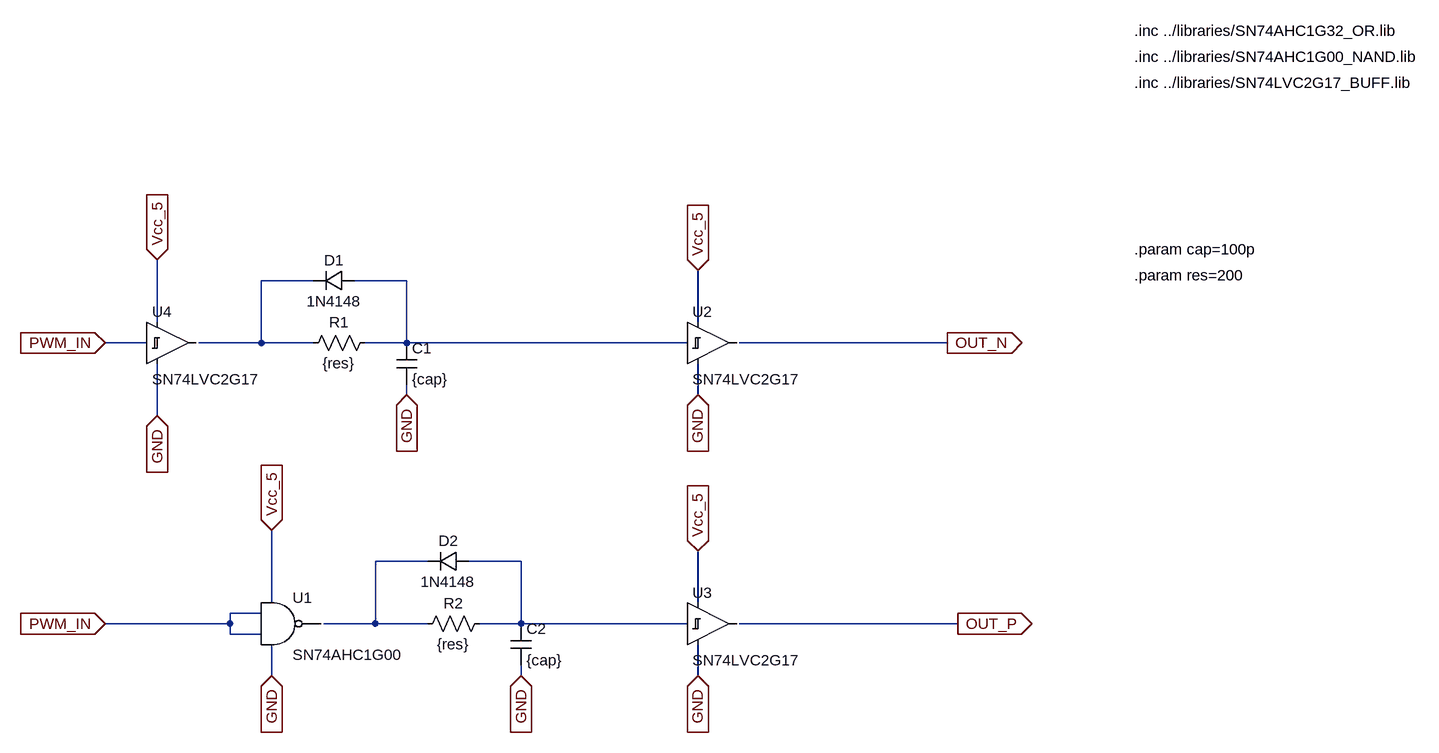
[diagram p0: schematic Deadtime_component.asc]
Deadtime_component.asc, the LTspice schematic file:
Version 4
SHEET 1 1604 848
WIRE -640 80 -720 80
WIRE -496 80 -576 80
WIRE -880 144 -880 48
WIRE -48 144 -48 64
WIRE -896 176 -960 176
WIRE -720 176 -720 80
WIRE -720 176 -816 176
WIRE -640 176 -720 176
WIRE -496 176 -496 80
WIRE -496 176 -560 176
WIRE -64 176 -496 176
WIRE 336 176 16 176
WIRE -496 256 -496 240
WIRE -48 256 -48 208
WIRE -880 288 -880 208
WIRE -464 512 -544 512
WIRE -320 512 -400 512
WIRE -704 576 -704 464
WIRE -48 576 -48 496
WIRE -720 592 -768 592
WIRE -768 608 -768 592
WIRE -768 608 -960 608
WIRE -544 608 -544 512
WIRE -544 608 -624 608
WIRE -464 608 -544 608
WIRE -320 608 -320 512
WIRE -320 608 -384 608
WIRE -64 608 -320 608
WIRE 352 608 16 608
WIRE -768 624 -768 608
WIRE -720 624 -768 624
WIRE -704 688 -704 640
WIRE -320 688 -320 672
WIRE -48 688 -48 640
FLAG 352 608 OUT_P
IOPIN 352 608 Out
FLAG 336 176 OUT_N
IOPIN 336 176 Out
FLAG -960 608 PWM_IN
IOPIN -960 608 In
FLAG -496 256 GND
IOPIN -496 256 In
FLAG -960 176 PWM_IN
IOPIN -960 176 In
FLAG -320 688 GND
IOPIN -320 688 In
FLAG -48 688 GND
IOPIN -48 688 In
FLAG -48 256 GND
IOPIN -48 256 In
FLAG -48 64 Vcc_5
IOPIN -48 64 In
FLAG -48 496 Vcc_5
IOPIN -48 496 In
FLAG -704 464 Vcc_5
IOPIN -704 464 In
FLAG -704 688 GND
IOPIN -704 688 In
FLAG -880 48 Vcc_5
IOPIN -880 48 In
FLAG -880 288 GND
IOPIN -880 288 In
SYMBOL res -544 160 R90
WINDOW 0 0 56 VBottom 2
WINDOW 3 32 56 VTop 2
SYMATTR InstName R1
SYMATTR Value {res}
SYMBOL cap -512 176 R0
SYMATTR InstName C1
SYMATTR Value {cap}
SYMBOL diode -576 64 R90
WINDOW 0 0 32 VBottom 2
WINDOW 3 32 32 VTop 2
SYMATTR InstName D1
SYMATTR Value 1N4148
SYMBOL res -368 592 R90
WINDOW 0 0 56 VBottom 2
WINDOW 3 32 56 VTop 2
SYMATTR InstName R2
SYMATTR Value {res}
SYMBOL cap -336 608 R0
SYMATTR InstName C2
SYMATTR Value {cap}
SYMBOL diode -400 496 R90
WINDOW 0 0 32 VBottom 2
WINDOW 3 32 32 VTop 2
SYMATTR InstName D2
SYMATTR Value 1N4148
SYMBOL my_nand -688 544 R0
SYMATTR InstName U1
SYMBOL schmitt_buffer -64 112 R0
SYMATTR InstName U2
SYMBOL schmitt_buffer -64 544 R0
SYMATTR InstName U3
SYMBOL schmitt_buffer -896 112 R0
SYMATTR InstName U4
TEXT 624 -304 Left 2 !.inc ../libraries/SN74AHC1G32_OR.lib
TEXT 624 -264 Left 2 !.inc ../libraries/SN74AHC1G00_NAND.lib
TEXT 624 -224 Left 2 !.inc ../libraries/SN74LVC2G17_BUFF.lib
TEXT 624 32 Left 2 !.param cap=100p
TEXT 624 72 Left 2 !.param res=200

The netlist it stands for:
* Deadtime_component.asc
R1 N002 N001 {res}
C1 N002 GND {cap}
D1 N002 N001 1N4148
R2 N004 N003 {res}
C2 N004 GND {cap}
D2 N004 N003 1N4148
XU1 N003 PWM_IN PWM_IN Vcc_5 GND SN74AHC1G00  ; pins Y A B VCC AGND
XU2 OUT_N N002 Vcc_5 GND SN74LVC2G17  ; pins Y A VCC AGND
XU3 OUT_P N004 Vcc_5 GND SN74LVC2G17  ; pins Y A VCC AGND
XU4 N001 PWM_IN Vcc_5 GND SN74LVC2G17  ; pins Y A VCC AGND
.model D D
.lib standard.dio
.inc ../libraries/SN74AHC1G32_OR.lib
.inc ../libraries/SN74AHC1G00_NAND.lib
.inc ../libraries/SN74LVC2G17_BUFF.lib
.param cap=100p
.param res=200
.backanno
.end